# EAGLE schematic dropweight_test_v6 (EAGLE 9.7.0)
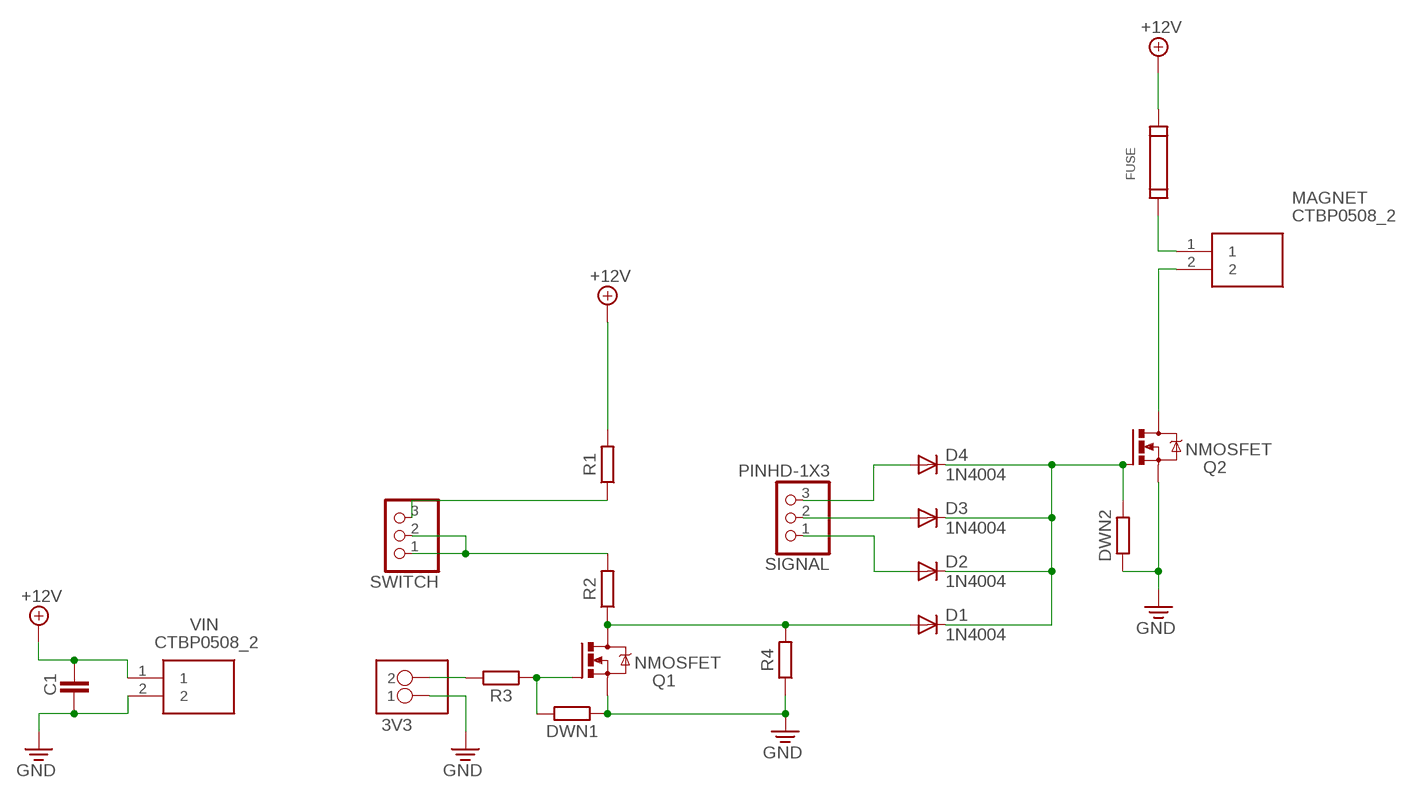
[diagram p0: schematic, sheet 1]

## Parts
3V3  PINHD-1X02_1X02M  [1X02]
C1  CAPACITORCERAMIC-2.54MM  [CAP-THRU-2.54MM]
D1  1N4004  [DO41-10]
D2  1N4004  [DO41-10]
D3  1N4004  [DO41-10]
D4  1N4004  [DO41-10]
DWN1  RESISTOR-BACKUP_AXIAL-10.16MM-PITCH  [RESAD1016W63L850D250B]
DWN2  RESISTOR-BACKUP_AXIAL-10.16MM-PITCH  [RESAD1016W63L850D250B]
FUSE  696108003002  [696108003002]
MAGNET  CTBP0508_2  [CTBP05082]
Q1  NMOSFET  NMOSFET__TO220  [TO220BV]
Q2  NMOSFET  NMOSFET__TO220  [TO220BV]
R1  RESISTOR-BACKUP_AXIAL-10.16MM-PITCH  [RESAD1016W63L850D250B]
R2  RESISTOR-BACKUP_AXIAL-10.16MM-PITCH  [RESAD1016W63L850D250B]
R3  RESISTOR-BACKUP_AXIAL-10.16MM-PITCH  [RESAD1016W63L850D250B]
R4  RESISTOR-BACKUP_AXIAL-10.16MM-PITCH  [RESAD1016W63L850D250B]
SIGNAL  PINHD-1X3  [1X03]
SWITCH  PINHD-1X3  [1X03]
VIN  CTBP0508_2  [CTBP05082]

## Nets
3V3: 3V3.2 R3.2
+12V: C1.1 FUSE.2 R1.2 VIN.1
GND [New Class]: 3V3.1 C1.2 DWN1.1 DWN2.1 Q1.S Q2.S R4.1 VIN.2
N$1: R1.1 SWITCH.3
N$2: R2.2 SWITCH.1 SWITCH.2
N$3: D1.A Q1.D R2.1 R4.2
N$4: DWN1.2 Q1.G R3.1
N$6: MAGNET.2 Q2.D
N$7: D3.A SIGNAL.2
N$8: D4.A SIGNAL.3
N$9: D2.A SIGNAL.1
N$10: FUSE.1 MAGNET.1
N$11: D1.C D2.C D3.C D4.C DWN2.2 Q2.G

## Library data of the parts
3V3 = Tinkercad:PINHD-1X02
C1 = Tinkercad:CAPACITOR: Capacitor - Generic
D1-D4 = adafruit:1N4004: DIODE General purpose 1N400x type rectifier (With bigger pads) http://www.ladyada.net/library/pcb/eaglelibrary.html
DWN1 DWN2 R1-R4 = Tinkercad:RESISTOR-BACKUP: Resistor Fixed - Generic
FUSE = Wurth_Connectors_WR-FSH:696108003002: WR-FSH Fuseholder THT Blocks PCB Clip Cover MATERIAL PROPERTIES Insulator Material PA66 Insulator Flammability Rating UL94 V-0 Insulator Color Green Contact Material Copper Alloy Contact Plating Tin over Nickel Contact Type Stamped GENERAL INFORMATION Operating Temperature -30 up to +120 °C Compliance RoHS ELECTRICAL PROPERTIES IR UL 20 A IR VDE 6.3 A Working Voltage [UL] 250 V (AC) Working Voltage [VDE] 250 V (AC) Withstanding Voltage [UL] 1500 V (AC) Withstanding Voltage [cULus] 1500 V (AC) Withstanding Voltage [VDE] 1500 V (AC) Contact Resistance 10 mΩ Contact Resistance [VDE] 10 mΩ MECHANICAL PROPERTIES Protection Class I & II Fuse Size 5x20 mm CERTIFICATION cULus Approval E157417 VDE Approval 129302 PACKAGING PROPERTIES Packaging Box <https://katalog.we-online.com/media/images/v2/o33102v209%20Family_WR-FSH_69610X003002.jpg> Details see: https://katalog.we-online.com/en/em/FSH_THT_PCB_CLIP_COVER_69610X003002 Updated by Ella Wu 2019-10-25 2019 (C) Wurth Elektronik; DATASHEET-URL: https://www.we-online.com/catalog/datasheet/696108003002.pdf; IR-UL: 20A; IR-VDE: 6.3A; MATES: 696122003001; PART-NUMBER: 696108003002
MAGNET VIN = CTBP0508_2:CTBP0508_2: Conn Terminal Block F 2 POS 5.08mm Solder ST Thru-Hole 8A Source: Datasheet <https://static6.arrow.com/aropdfconversion/9b5fc771929c7e0117b52de15994f93b42c84896/ctbp0508_series_d.pdf>; DESCRIPTION: Conn Terminal Block F 2 POS 5.08mm Solder ST Thru-Hole 8A; HEIGHT: 10.2mm; MANUFACTURER_NAME: CAMDENBOSS; MANUFACTURER_PART_NUMBER: CTBP0508/2
Q1 Q2 = Tinkercad:NMOSFET: N-Channel MOSFET - Generic; CATEGORY: Transistor; SUB-CATEGORY: MOSFET; TYPE: N-Channel
SIGNAL = Connector:PINHD-1X3: PIN HEADER; CATEGORY: Headers; DESCRIPTION: Header, Straight, 3 Position; MANUFACTURER: Generic; MPN: Generic; OPERATING_TEMPERATURE: Generic; PART_STATUS: Active; PITCH: 0.100" (2.54mm); ROHS_COMPLIANCE: Generic; SERIES: Generic; SUB-CATEGORY: Headers, Male Pins; TYPE: Board to Board or Cable, Unshrouded, Through Hole, Straight
SWITCH = Airquality_Sensor:PINHD-1X3: PIN HEADER